# EAGLE design igniter (EAGLE 7.1.0)
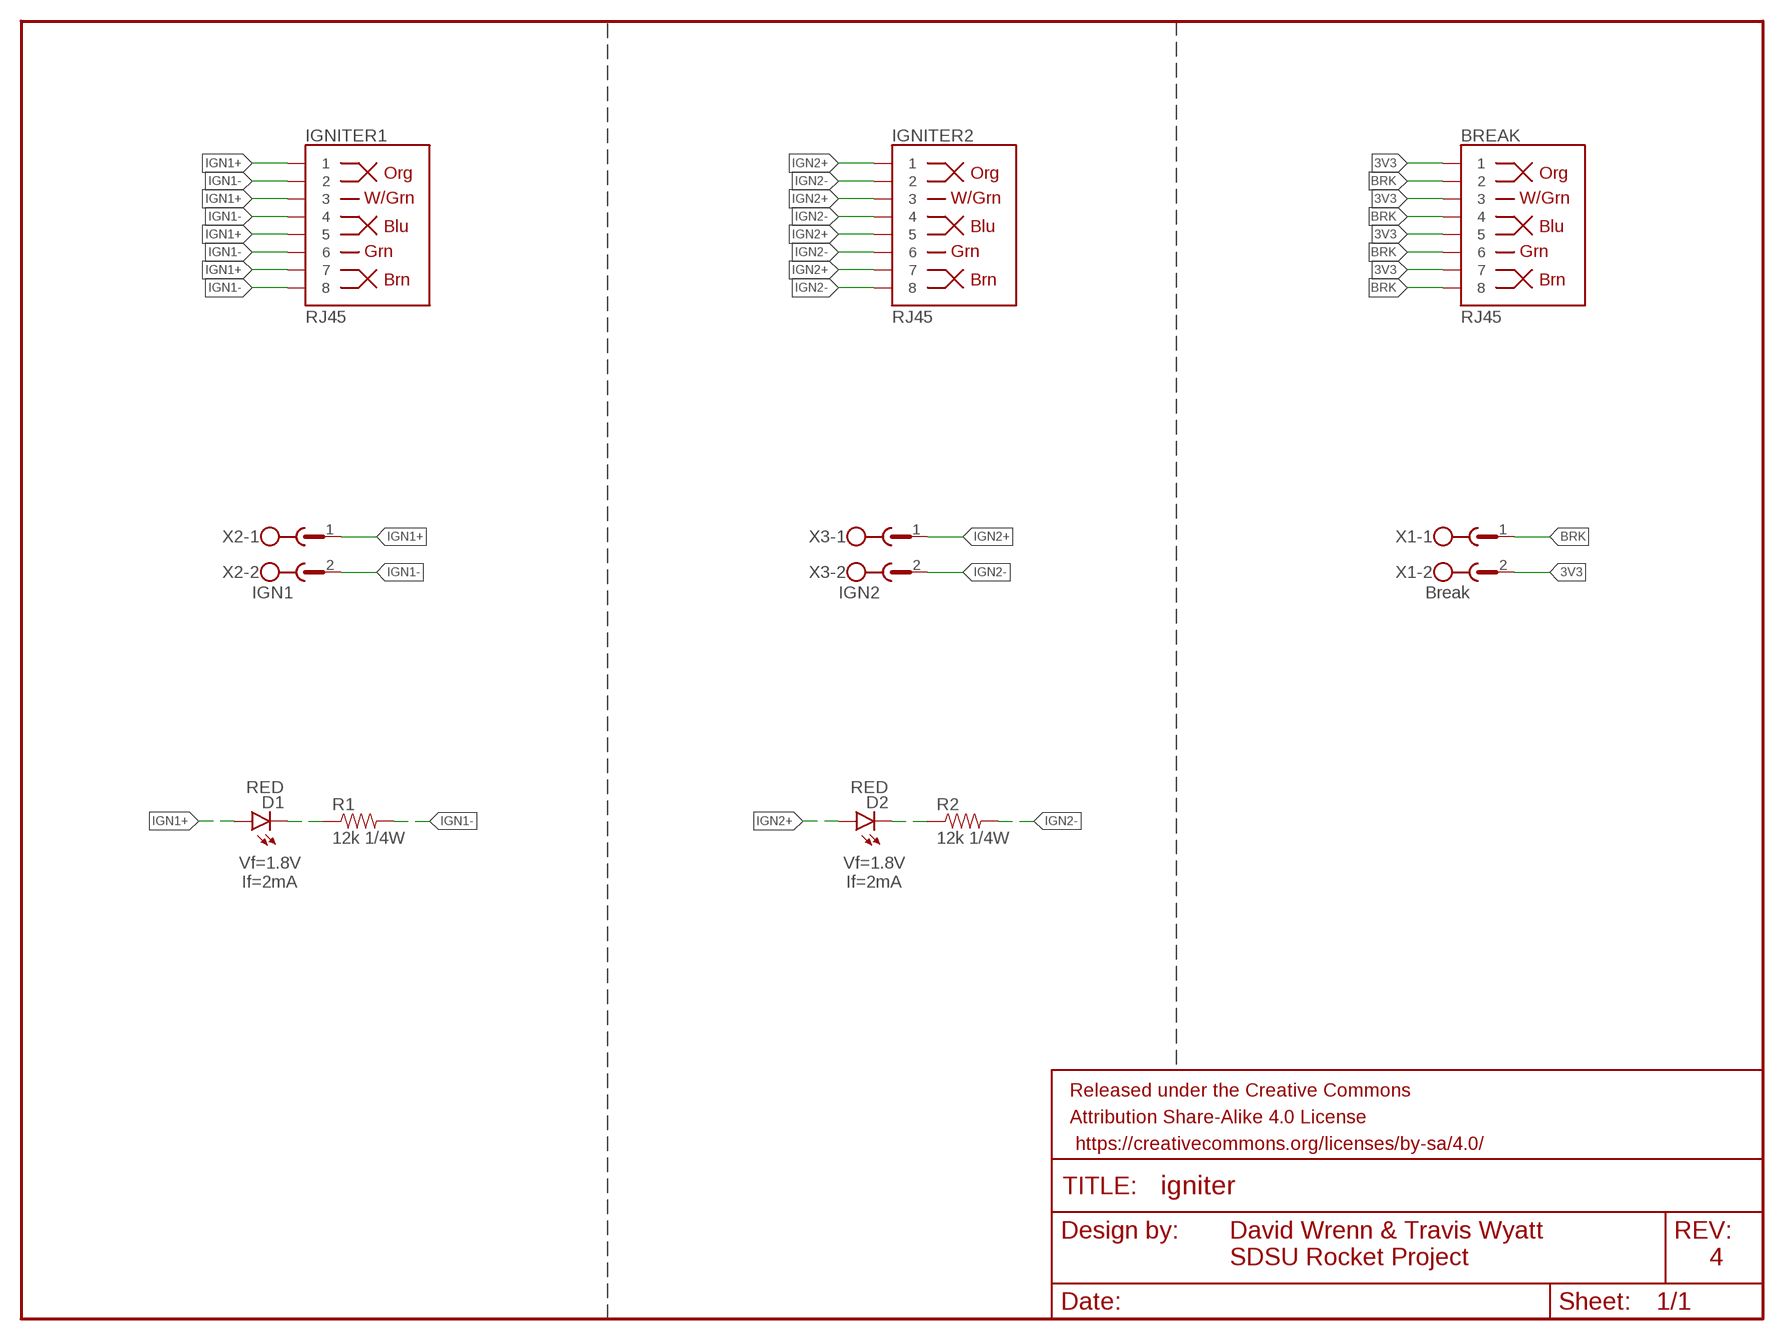
[diagram p0: schematic, sheet 1]

## Parts
BREAK  RJ45  RJ45-8PTH  [RJ45-8]
D1  RED  LED0603  [LED-0603]
D2  RED  LED0603  [LED-0603]
FRAME1  FRAME-LETTER  [CREATIVE_COMMONS]
IGNITER1  RJ45  RJ45-8PTH  [RJ45-8]
IGNITER2  RJ45  RJ45-8PTH  [RJ45-8]
R1  12k 1/4W  RESISTOR0603-RES  [0603-RES]
R2  12k 1/4W  RESISTOR0603-RES  [0603-RES]
X1  Break  MSTBA2  [MSTBA2]
X2  IGN1  MSTBA2  [MSTBA2]
X3  IGN2  MSTBA2  [MSTBA2]

## Nets
3V3: BREAK.1 BREAK.3 BREAK.5 BREAK.7 X1.2
BRK: BREAK.2 BREAK.4 BREAK.6 BREAK.8 X1.1
IGN1+: D1.A IGNITER1.1 IGNITER1.3 IGNITER1.5 IGNITER1.7 X2.1
IGN1-: IGNITER1.2 IGNITER1.4 IGNITER1.6 IGNITER1.8 R1.2 X2.2
IGN2+: D2.A IGNITER2.1 IGNITER2.3 IGNITER2.5 IGNITER2.7 X3.1
IGN2-: IGNITER2.2 IGNITER2.4 IGNITER2.6 IGNITER2.8 R2.2 X3.2
N$1: D1.C R1.1
N$2: D2.C R2.1

## Notes on the sheet
- Vf=1.8V
  If=2mA
- Vf=1.8V
  If=2mA
- David Wrenn & Travis Wyatt
- SDSU Rocket Project
- 4

## Library data of the parts
BREAK IGNITER1 IGNITER2 = SparkFun-Connectors:RJ45-8: RJ45 Jack Simple RJ45, 8-pin connection - connector for common Cat5, Cat5e, and Cat6 Ethernet cables. Footprint not yet proven in production. Connector sku is PRT-00643; Breakout PCB sku is BOB-00716.; PROD_ID: CONN-08506
D1 D2 = SparkFun-LED:LED: LEDs Standard schematic elements and footprints for 5mm, 3mm, 1206, and 0603 sized LEDs. 5mm - Spark Fun Electronics SKU : COM-00529 (and others)
FRAME1 = SparkFun-Aesthetics:FRAME-LETTER: Schematic Frame Standard 8.5x11 US Letter frame; DESIGNER: NAME; VERSION: v01
R1 R2 = SparkFun-Resistors:RESISTOR: Resistor Basic schematic elements and footprints for 0603, 1206, and PTH resistors.
X1-X3 = con-phoenix-508:MSTBA2: PHOENIX; MF: FARNELL; MPN: 1757242; OC_FARNELL: 3705171; OC_NEWARK: 71C4161

## Board
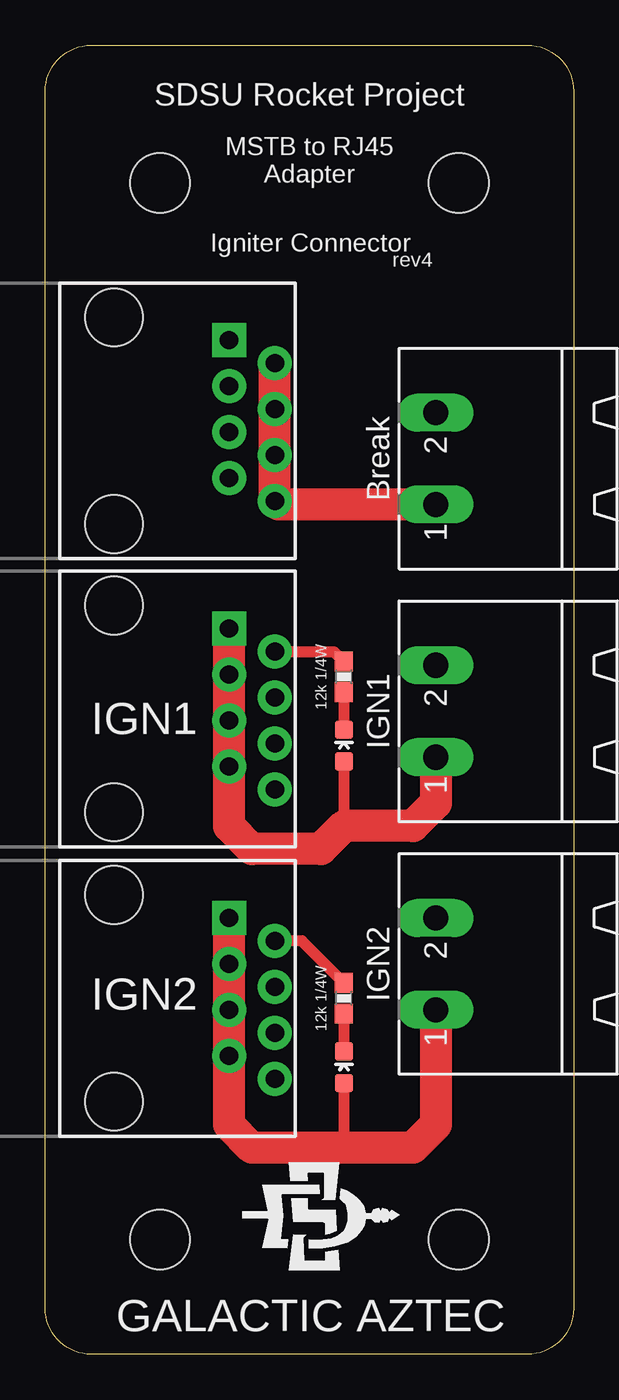
[diagram p1: board, top side]
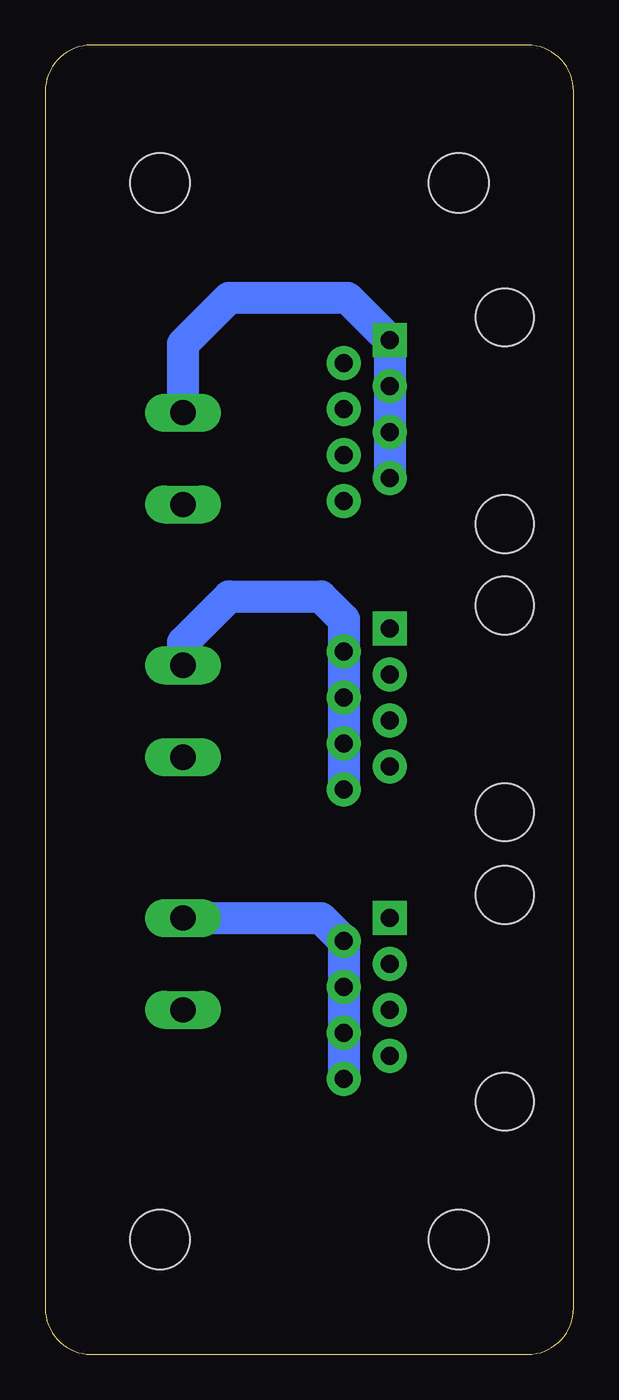
[diagram p2: board, bottom side, seen from below]

Size 29.21 x 72.39 mm. Coordinates in mm from the lower left corner, seen from the top.
Outline: 26.67,0 2.54,0 arc-90 0,2.54 0,69.85 arc-90 2.54,72.39 26.67,72.39 arc-90 29.21,69.85 29.21,2.54 arc-90 26.67,0
Copper layers (1*16): Top 0.0356mm / dielectric 1.5011mm / Bottom 0.0356mm
Design rules "SparkFunBestPractices": minimum track width 10mil, minimum drill 13mil, track to track 10mil, track to pad 10mil, pad to pad 10mil, via to via 10mil, smd to smd 10mil, copper to edge 15mil, drill to drill 12mil, minimum pad ring 7mil, minimum via ring 7mil, stop-mask expansion 3mil, vias tented up to drill 0mil, thermal gap 10mil

### Footprints (pad centres in the part's own frame; a part is rotated, then mirrored left to right if it is on the bottom)
RJ45-8 = drill 1 pad 1.88 square: 1 -4.445,6.35 | drill 1 pad 1.88: 2 -3.175,8.89; 3 -1.905,6.35; 4 -0.635,8.89; 5 0.635,6.35; 6 1.905,8.89; 7 3.175,6.35; 8 4.445,8.89 | hole 3.2: -5.715,0; 5.715,0
LED-0603 = smd 1 x 1: A 0,-0.877; C 0,0.877
0603-RES = smd 1.1 x 1: 1 -0.85,0; 2 0.85,0
STAND-OFF = hole 3.302: 0,0
MSTBA2 = drill 1.397 long: 1 -2.54,5.08; 2 2.54,5.08

### Placement (x,y rotation side)
BREAK  3.81,51.63 270 top
D1  16.51,33.66 0 top
D2  16.51,15.88 0 top
FRAME1  46.99,0 90 top  (outside the outline)
IGNITER1  3.81,35.69 270 top
IGNITER2  3.81,19.68 270 top
R1  16.51,37.47 90 top
R2  16.51,19.68 90 top
U$1  [STAND-OFF]  22.86,6.35 0 top
U$2  [STAND-OFF]  6.35,6.35 0 top
U$3  [STAND-OFF]  22.86,64.77 0 top
U$4  [STAND-OFF]  6.35,64.77 0 top
X1  26.67,49.53 90 top
X2  26.67,35.56 90 top
X3  26.67,21.59 90 top

### Tracks (layer width: path | path; a pad name or v marks a point on that pad's centre or on a via)
3V3
  Bottom 1.778: X1.2 21.59,55.88 19.05,58.42 12.51,58.42 BREAK.1 BREAK.3 BREAK.5 BREAK.7
BRK
  Top 1.778: X1.1 12.89,46.99 BREAK.8 BREAK.6 BREAK.4 BREAK.2
IGN1+
  Top 0.61: D1.A 16.51,29.21
  Top 1.778: X2.1 21.59,30.48 20.32,29.21 16.51,29.21 15.24,27.94 11.43,27.94 10.16,29.21 IGNITER1.7 IGNITER1.5 IGNITER1.3 IGNITER1.1
IGN1-
  Top 0.61: IGNITER1.2 15.96,38.86 R1.2
  Bottom 1.778: X2.2 21.59,39.37 19.05,41.91 13.97,41.91 12.7,40.64 IGNITER1.2 IGNITER1.4 IGNITER1.6 IGNITER1.8
IGN2+
  Top 0.61: D2.A 16.51,11.43
  Top 0.813: 15.63,11.82 15.24,11.43
  Top 1.016: 15.06,11.61 15.24,11.43
  Top 1.778: X3.1 21.59,12.7 20.32,11.43 16.51,11.43 15.24,11.43 11.43,11.43 10.16,12.7 IGNITER2.7 IGNITER2.5 IGNITER2.3 IGNITER2.1
IGN2-
  Top 0.61: R2.2 14.19,22.86 IGNITER2.2
  Bottom 1.778: X3.2 13.97,24.13 IGNITER2.2 IGNITER2.4 IGNITER2.6 IGNITER2.8
N$1
  Top 0.61: R1.1 D1.C
N$2
  Top 0.61: R2.1 D2.C

### Text on the board
tNames: SDSU Rocket Project | MSTB to RJ45 / Adapter | Igniter Connector | rev4 | IGN1 | IGN2 | GALACTIC AZTEC